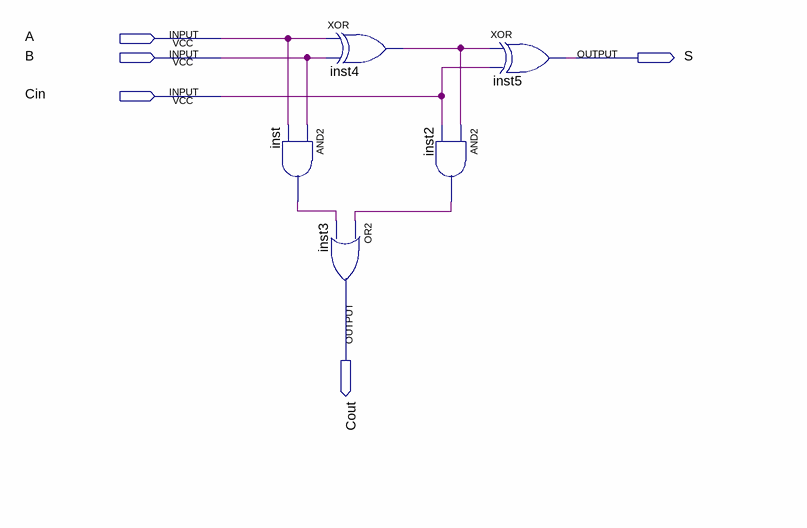
[diagram p0: schematic sheet]
// Quartus schematic Full_Adder.bdf as structural Verilog: 5 symbols, 5 pins
module Full_Adder (
  input  A,
  input  B,
  input  Cin,
  output S,
  output Cout
);

  wire inst2_out, inst4_out, inst_out;

  xor inst4 (inst4_out, A, B);
  and inst (inst_out, B, A);
  or inst3 (Cout, inst2_out, inst_out);
  xor inst5 (S, inst4_out, Cin);
  and inst2 (inst2_out, inst4_out, Cin);
endmodule
